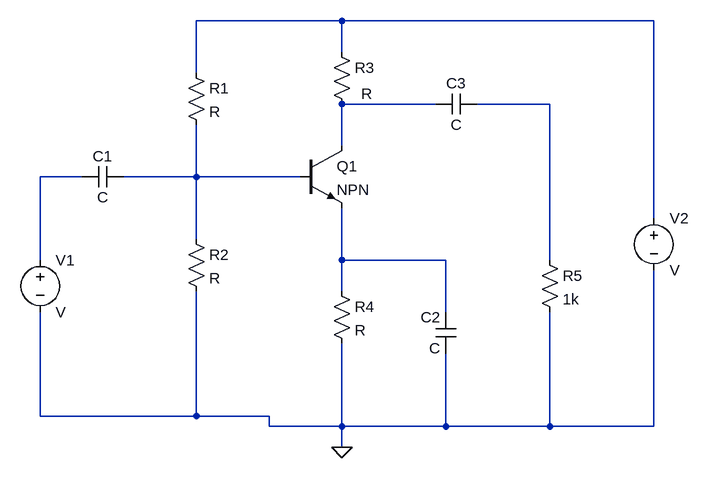
[diagram p0: schematic ECE2285_Project2_BJT.asc]
ECE2285_Project2_BJT.asc, the LTspice schematic file:
Version 4
SHEET 1 1164 680
WIRE 624 -32 400 -32
WIRE 1104 -32 624 -32
WIRE 624 16 624 -32
WIRE 400 48 400 -32
WIRE 768 96 624 96
WIRE 944 96 832 96
WIRE 624 160 624 96
WIRE 224 208 160 208
WIRE 400 208 400 128
WIRE 400 208 288 208
WIRE 560 208 400 208
WIRE 1104 272 1104 -32
WIRE 400 304 400 208
WIRE 160 336 160 208
WIRE 624 336 624 256
WIRE 784 336 624 336
WIRE 944 336 944 96
WIRE 624 384 624 336
WIRE 784 416 784 336
WIRE 160 576 160 416
WIRE 400 576 400 384
WIRE 400 576 160 576
WIRE 512 576 400 576
WIRE 512 592 512 576
WIRE 624 592 624 464
WIRE 624 592 512 592
WIRE 784 592 784 480
WIRE 784 592 624 592
WIRE 944 592 944 416
WIRE 944 592 784 592
WIRE 1104 592 1104 352
WIRE 1104 592 944 592
WIRE 624 624 624 592
FLAG 624 624 0
SYMBOL cap 288 192 R90
WINDOW 0 0 32 VBottom 2
WINDOW 3 32 32 VTop 2
SYMATTR InstName C1
SYMBOL cap 800 480 R180
WINDOW 0 24 56 Left 2
WINDOW 3 24 8 Left 2
SYMATTR InstName C2
SYMBOL res 384 32 R0
SYMATTR InstName R1
SYMBOL res 384 288 R0
SYMATTR InstName R2
SYMBOL res 608 0 R0
WINDOW 3 46 80 Left 2
SYMATTR InstName R3
SYMBOL res 928 320 R0
SYMATTR InstName R5
SYMATTR Value 1k
SYMBOL res 608 368 R0
SYMATTR InstName R4
SYMBOL voltage 160 320 R0
SYMATTR InstName V1
SYMBOL npn 560 160 R0
SYMATTR InstName Q1
SYMBOL cap 832 80 R90
WINDOW 0 0 32 VBottom 2
WINDOW 3 32 32 VTop 2
SYMATTR InstName C3
SYMBOL voltage 1104 256 R0
SYMATTR InstName V2

The netlist it stands for:
* ECE2285_Project2_BJT.asc
C1 N005 N004 C
C2 0 N006 C
R1 N001 N005 R
R2 N005 0 R
R3 N001 N002 R
R5 N003 0 1k
R4 N006 0 R
V1 N004 0 V
Q1 N002 N005 N006 0 NPN
C3 N003 N002 C
V2 N001 0 V
.model NPN NPN
.model PNP PNP
.lib standard.bjt
.backanno
.end